# EasyEDA schematic Schematic.json
TITLE: Raspi_Control_Board; REV: 1.0; Date: 2025-10-25; Sheet: 1/1; Drawn By: BilalSwl6; Company: BilalSwl6
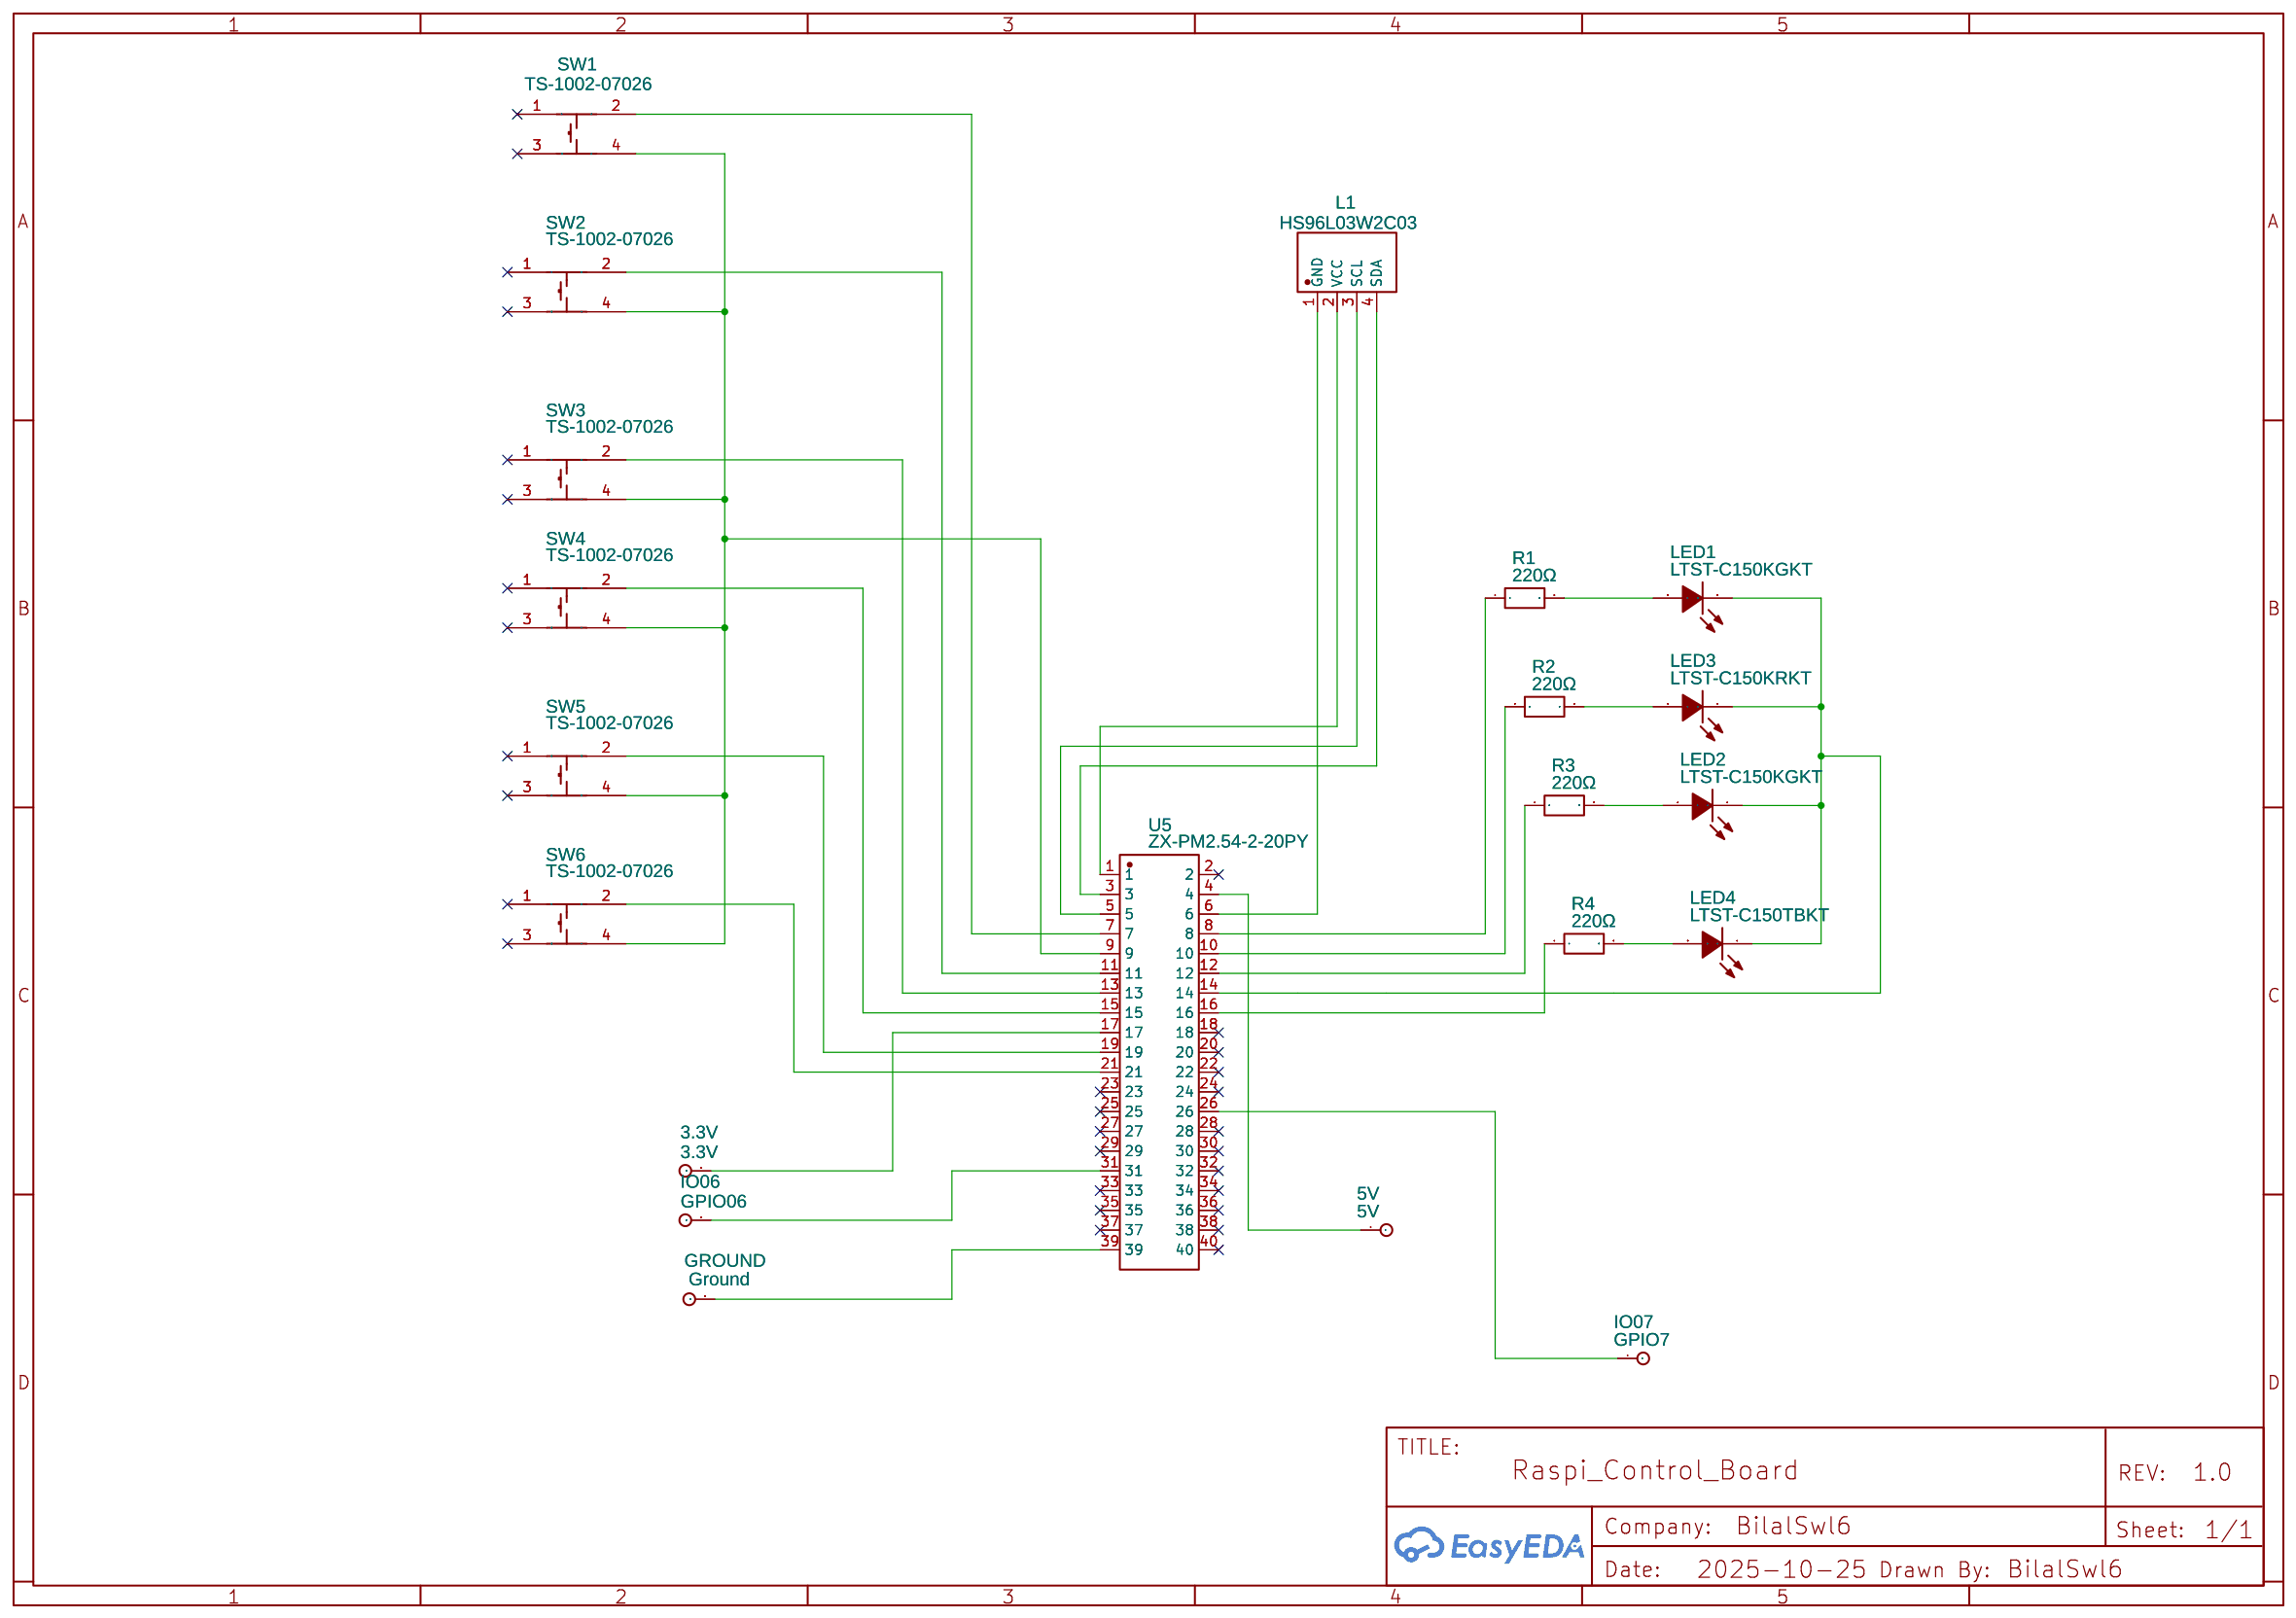
[diagram p0: schematic sheet]

## Parts
3.3V  3.3V  [TESTPOINT:TESTPOINT_THTPAD_D1.0MM_DRILL0.5MM]
5V  5V  [TESTPOINT:TESTPOINT_THTPAD_D1.0MM_DRILL0.5MM]
GROUND  Ground  [TESTPOINT:TESTPOINT_THTPAD_D1.0MM_DRILL0.5MM]
IO06  GPIO06  [TESTPOINT:TESTPOINT_THTPAD_D1.0MM_DRILL0.5MM]
IO07  GPIO7  [TESTPOINT:TESTPOINT_THTPAD_D1.0MM_DRILL0.5MM]
L1  HS96L03W2C03  [OLED-TH_L27.8-W27.2-P2.54_C9900033791]
LED1  LTST-C150KGKT  [LED1206-RD]
LED2  LTST-C150KGKT  [LED1206-RD]
LED3  LTST-C150KRKT  [LED1206-RD]
LED4  LTST-C150TBKT  [LED1206-RD_BLUE]
R1  220Ω  [R1206]
R2  220Ω  [R1206]
R3  220Ω  [R1206]
R4  220Ω  [R1206]
SW1  TS-1002-07026  [SW-TH_4P-L6.0-W6.0-P4.50-LS6.5]
SW2  TS-1002-07026  [SW-TH_4P-L6.0-W6.0-P4.50-LS6.5]
SW3  TS-1002-07026  [SW-TH_4P-L6.0-W6.0-P4.50-LS6.5]
SW4  TS-1002-07026  [SW-TH_4P-L6.0-W6.0-P4.50-LS6.5]
SW5  TS-1002-07026  [SW-TH_4P-L6.0-W6.0-P4.50-LS6.5]
SW6  TS-1002-07026  [SW-TH_4P-L6.0-W6.0-P4.50-LS6.5]
U5  ZX-PM2.54-2-20PY  [HDR-TH_40P-P2.54-V-F-R2-C20-S2.54]

## Library data of the parts
3.3V 5V GROUND IO06 IO07 = Connector_TestPoint: Add into BOM: yes; Convert to PCB: yes; Origin Footprint: TestPoint:TestPoint_THTPad_D1.0mm_Drill0.5mm; Contributor: thulasikrishna
L1 = HS96L03W2C03: Contributor: lcsc; Supplier: LCSC; Supplier Part: C5248080; Manufacturer: HS(汉昇); JLCPCB Part Class: Extended Part
LED1 LED2 = LTST-C150KGKT: Contributor: LCSC; Supplier: LCSC; Manufacturer: LITEON(光宝); Supplier Part: C125085; JLCPCB Part Class: Extended Part
LED3 = LTST-C150KRKT: Contributor: LCSC; Supplier: LCSC; Manufacturer: LITEON(光宝); Supplier Part: C125086; JLCPCB Part Class: Extended Part
LED4 = LTST-C150TBKT: Contributor: LCSC; Supplier: LCSC; Manufacturer: LITEON(光宝); Supplier Part: C125088; JLCPCB Part Class: Extended Part
R1-R4 = FRC1206J221 TS: Supplier: LCSC; Supplier Part: C2933785; Manufacturer: FOJAN(富捷); JLCPCB Part Class: Extended Part; Contributor: lcsc
SW1-SW6 = TS-1002-07026: Contributor: LCSC; Supplier: LCSC; Supplier Part: C455095; Manufacturer: XUNPU(讯普); JLCPCB Part Class: Extended Part
U5 = ZX-PM2.54-2-20PY: Supplier: LCSC; Supplier Part: C7499354; Manufacturer: Megastar(兆星); Contributor: lcsc; JLCPCB Part Class: Extended Part

## Nets
Net-(3.3V-1): 3.3V.1 U5.17
Net-(5V-1): 5V.1 U5.4
Net-(GROUND-1): GROUND.1 U5.39
Net-(IO06-1): IO06.1 U5.31
Net-(IO07-1): IO07.1 U5.26
Net-(L1-1): L1.1(GND) U5.6
Net-(L1-2): L1.2(VCC) U5.1
Net-(L1-3): L1.3(SCL) U5.5
Net-(L1-4): L1.4(SDA) U5.3
Net-(LED1-1): LED1.1(K) LED2.1(K) LED3.1(K) LED4.1(K) U5.14
Net-(LED1-2): LED1.2(A) R1.2
Net-(LED2-2): LED2.2(A) R3.2
Net-(LED3-2): LED3.2(A) R2.2
Net-(LED4-2): LED4.2(A) R4.2
Net-(R1-1): R1.1 U5.8
Net-(R2-1): R2.1 U5.10
Net-(R3-1): R3.1 U5.12
Net-(R4-1): R4.1 U5.16
Net-(SW1-2): SW1.2 U5.7
Net-(SW1-4): SW1.4 SW2.4 SW3.4 SW4.4 SW5.4 SW6.4 U5.9
Net-(SW2-2): SW2.2 U5.11
Net-(SW3-2): SW3.2 U5.13
Net-(SW4-2): SW4.2 U5.15
Net-(SW5-2): SW5.2 U5.19
Net-(SW6-2): SW6.2 U5.21

Not connected (* = marked no-connect by the designer): SW1 1* 3*; SW2 1* 3*; SW3 1* 3*; SW4 1* 3*; SW5 1* 3*; SW6 1* 3*; U5 2* 18* 20* 22* 23* 24* 25* 27* 28* 29* 30* 32* 33* 34* 35* 36* 37* 38* 40*
